# EAGLE design NSE2020_2 (EAGLE 9.4.2)
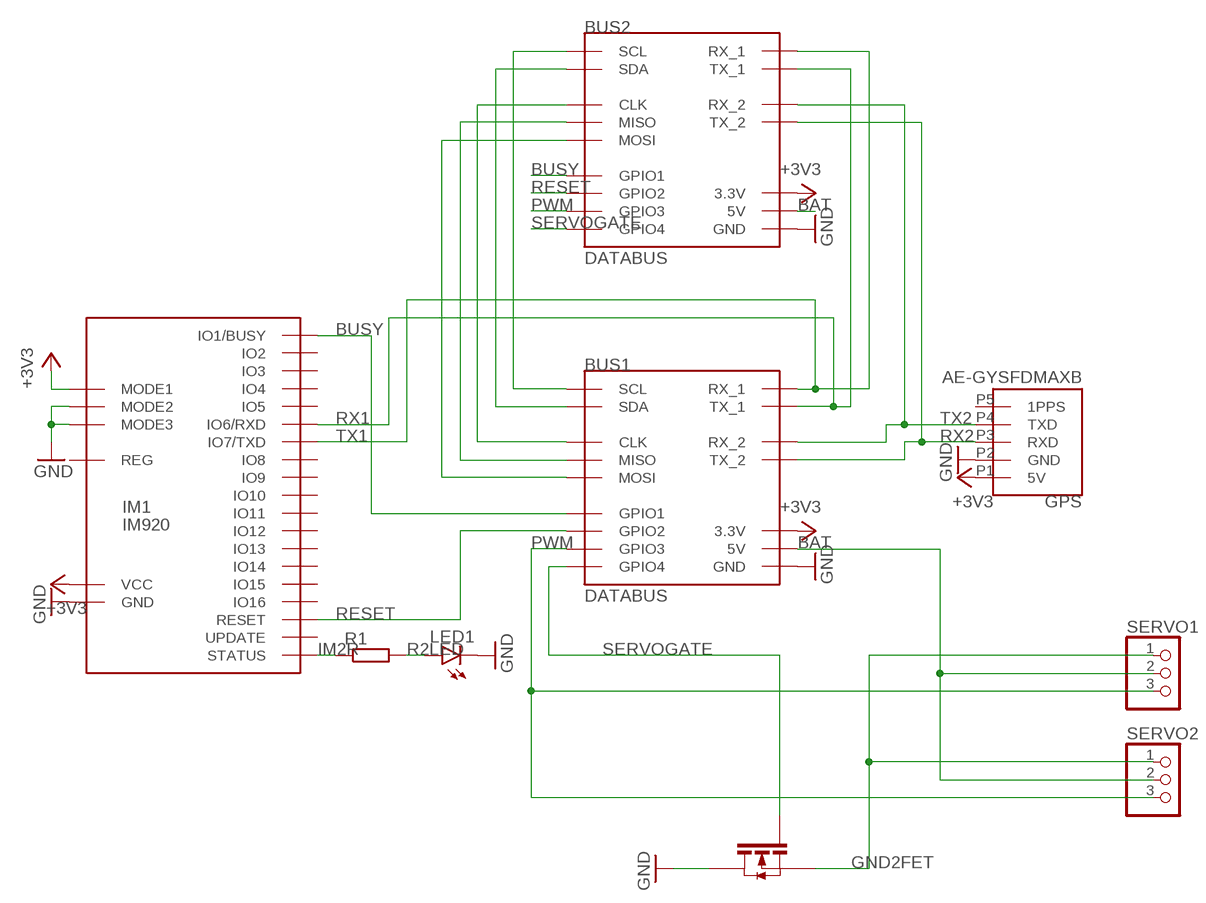
[diagram p0: schematic, sheet 1]

## Parts
BUS1  DATABUS  [8X2]
BUS2  DATABUS  [8X2]
FET1  2SK4033  [2SK4033]
GPS  AE-GYSFDMAXB  [AE-GYSFDMAXB]
IM1  IM920  [IM920]
LED1  LEDSMT1206  [1206]
R1  R-EU_M2012  [M2012]
SERVO1  PINHD-1X3  [1X03]
SERVO2  PINHD-1X3  [1X03]

## Nets
+3V3 [PWR]: BUS1.P6(3.3V) BUS2.P6(3.3V) GPS.P1(5V) IM1.IO2(VCC) IM1.IO5(MODE1)
BAT [PWR]: BUS1.P7(5V) BUS2.P7(5V) SERVO1.2 SERVO2.2
BUSY: BUS1.P3(GPIO1) BUS2.P3(GPIO1) IM1.IO13(IO1/BUSY)
GND [GND]: BUS1.P11(GND) BUS2.P11(GND) FET1.P$1(D) FET1.P$2(D) GPS.P2(GND) IM1.IO4(MODE3) IM1.IO22(MODE2) IM1.IO25(GND) LED1.C
GND2FET [GND]: FET1.P$4(S) SERVO1.1 SERVO2.1
IM2R: IM1.IO3(STATUS) R1.1
N$1: BUS1.P0(SCL) BUS2.P0(SCL)
N$2: BUS1.P13(SDA) BUS2.P13(SDA)
N$3: BUS1.P1(CLK) BUS2.P1(CLK)
N$4: BUS1.P12(MISO) BUS2.P12(MISO)
N$5: BUS1.P2(MOSI) BUS2.P2(MOSI)
PWM: BUS1.P14(GPIO3) BUS2.P14(GPIO3) SERVO1.3 SERVO2.3
R2LED: LED1.A R1.2
RESET: BUS1.P10(GPIO2) BUS2.P10(GPIO2) IM1.IO1(RESET)
RX1: BUS1.P5(TX_1) BUS2.P5(TX_1) IM1.IO16(IO6/RXD)
RX2: BUS1.P8(TX_2) BUS2.P8(TX_2) GPS.P3(RXD)
SERVOGATE: BUS1.P15(GPIO4) BUS2.P15(GPIO4) FET1.P$3(G)
TX1: BUS1.P4(RX_1) BUS2.P4(RX_1) IM1.IO10(IO7/TXD)
TX2: BUS1.P9(RX_2) BUS2.P9(RX_2) GPS.P4(TXD)
Unconnected: GPS.P5(1PPS) IM1.IO6(IO15) IM1.IO7(IO13) IM1.IO8(IO11) IM1.IO9 IM1.IO11(IO5) IM1.IO12(IO3) IM1.IO14(IO2) IM1.IO15(IO4) IM1.IO17(IO8) IM1.IO18(IO10) IM1.IO19(IO12) IM1.IO20(IO14) IM1.IO21(IO16) IM1.IO23(UPDATE) IM1.IO24(REG)

## Library data of the parts
BUS1 BUS2 = databus:DATABUS
FET1 = 2SK4033:2SK4033
GPS = AE-GYSFDMAXB:AE-GYSFDMAXB
IM1 = IM920:IM920
LED1 = led:LED: LED OSRAM: - CHIPLED LG R971, LG N971, LY N971, LG Q971, LY Q971, LO R971, LY R971 LH N974, LH R974 LS Q976, LO Q976, LY Q976 LO Q996 - Hyper CHIPLED LW Q18S LB Q993, LB Q99A, LB R99A - SideLED LS A670, LO A670, LY A670, LG A670, LP A670 LB A673, LV A673, LT A673, LW A673 LH A674 LY A675 LS A676, LA A676, LO A676, LY A676, LW A676 LS A679, LY A679, LG A679 - Hyper Micro SIDELED® LS Y876, LA Y876, LO Y876, LY Y876 LT Y87S - SmartLED LW L88C, LW L88S LB L89C, LB L89S, LG L890 LS L89K, LO L89K, LY L89K LS L896, LA L896, LO L896, LY L896 - TOPLED LS T670, LO T670, LY T670, LG T670, LP T670 LSG T670, LSP T670, LSY T670, LOP T670, LYG T670 LG T671, LOG T671, LSG T671 LB T673, LV T673, LT T673, LW T673 LH T674 LS T676, LA T676, LO T676, LY T676, LB T676, LH T676, LSB T676, LW T676 LB T67C, LV T67C, LT T67C, LS T67K, LO T67K, LY T67K, LW E67C LS E67B, LA E67B, LO E67B, LY E67B, LB E67C, LV E67C, LT E67C LW T67C LS T679, LY T679, LG T679 LS T770, LO T770, LY T770, LG T770, LP T770 LB T773, LV T773, LT T773, LW T773 LH T774 LS E675, LA E675, LY E675, LS T675 LS T776, LA T776, LO T776, LY T776, LB T776 LHGB T686 LT T68C, LB T68C - Hyper Mini TOPLED® LB M676 - Mini TOPLED Santana® LG M470 LS M47K, LO M47K, LY M47K Source: http://www.osram.convergy.de LUXEON: - LUMILED® LXK2-PW12-R00, LXK2-PW12-S00, LXK2-PW14-U00, LXK2-PW14-V00 LXK2-PM12-R00, LXK2-PM12-S00, LXK2-PM14-U00 LXK2-PE12-Q00, LXK2-PE12-R00, LXK2-PE12-S00, LXK2-PE14-T00, LXK2-PE14-U00 LXK2-PB12-K00, LXK2-PB12-L00, LXK2-PB12-M00, LXK2-PB14-N00, LXK2-PB14-P00, LXK2-PB14-Q00 LXK2-PR12-L00, LXK2-PR12-M00, LXK2-PR14-Q00, LXK2-PR14-R00 LXK2-PD12-Q00, LXK2-PD12-R00, LXK2-PD12-S00 LXK2-PH12-R00, LXK2-PH12-S00 LXK2-PL12-P00, LXK2-PL12-Q00, LXK2-PL12-R00 Source: www.luxeon.com KINGBRIGHT: KA-3528ASYC Source: www.kingbright.com
R1 = rcl:R-EU_: RESISTOR, European symbol; SPICEPREFIX: R
SERVO1 SERVO2 = pinhead:PINHD-1X3: PIN HEADER

## Net classes
1 GND: width 0.635 mm
2 PWR: width 0.635 mm

## Board
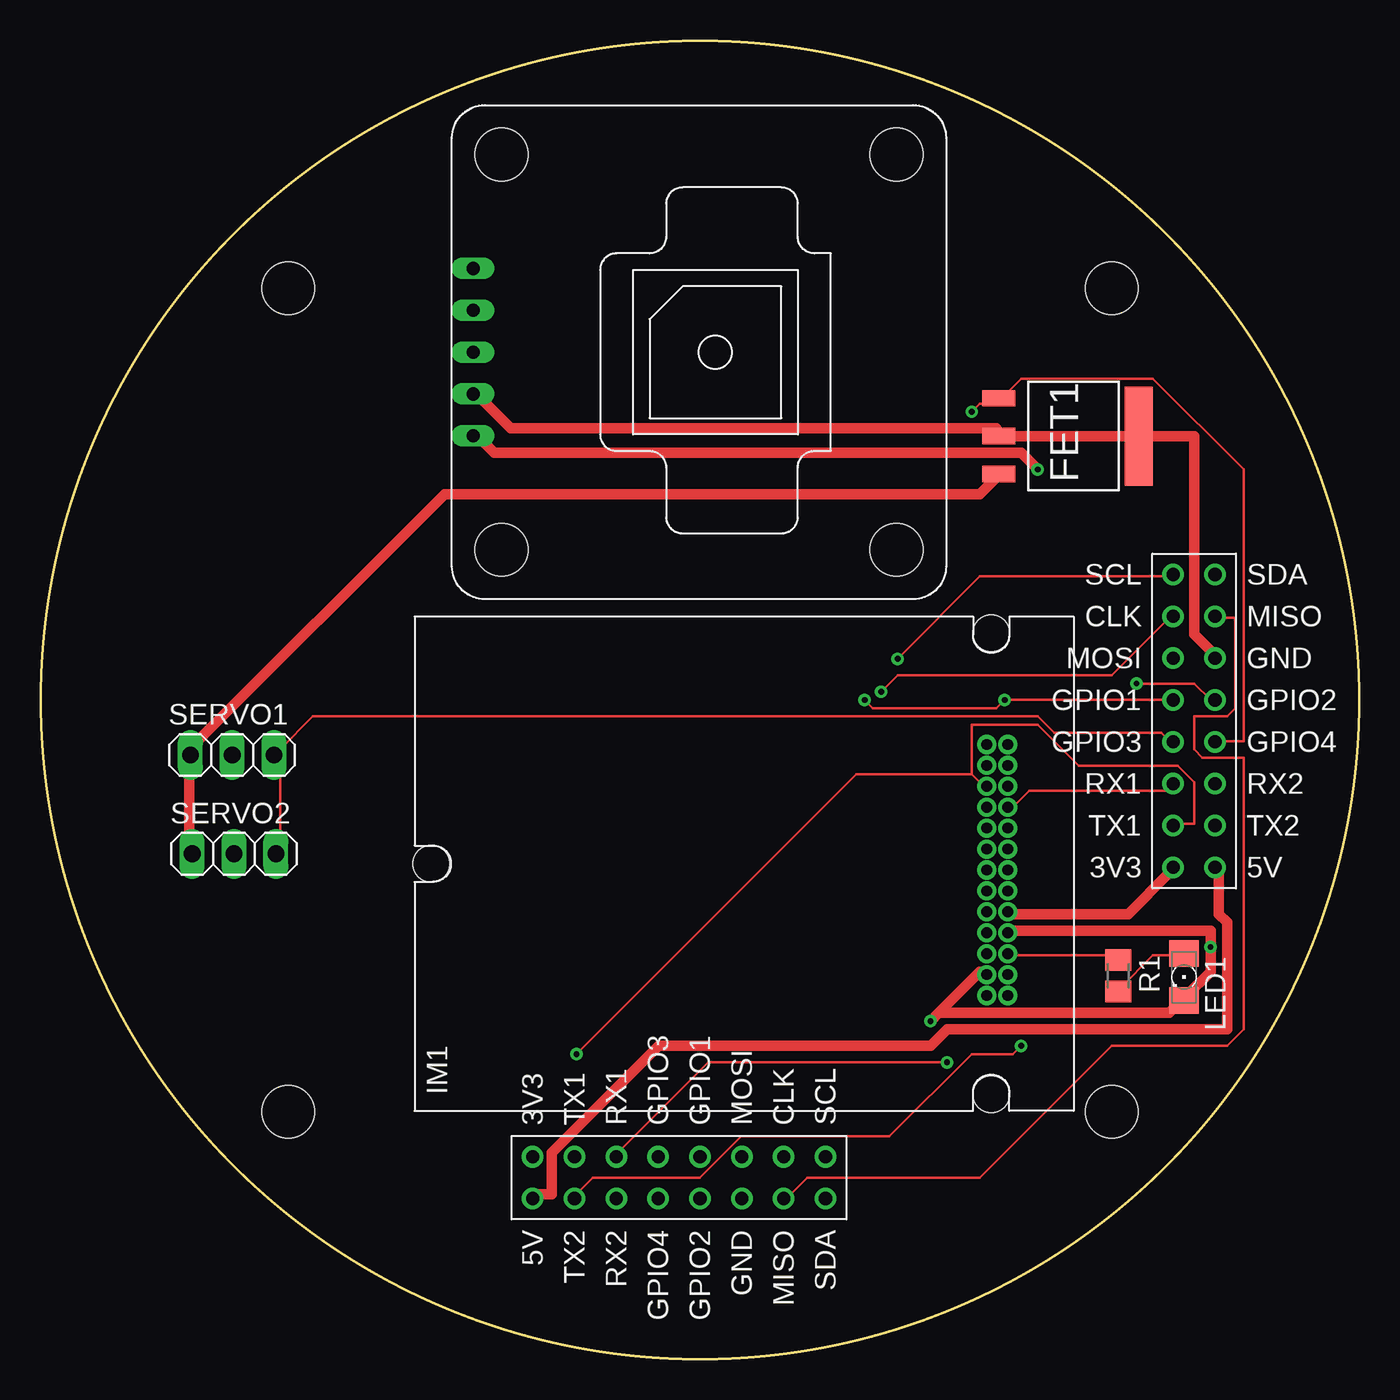
[diagram p1: board, top side]
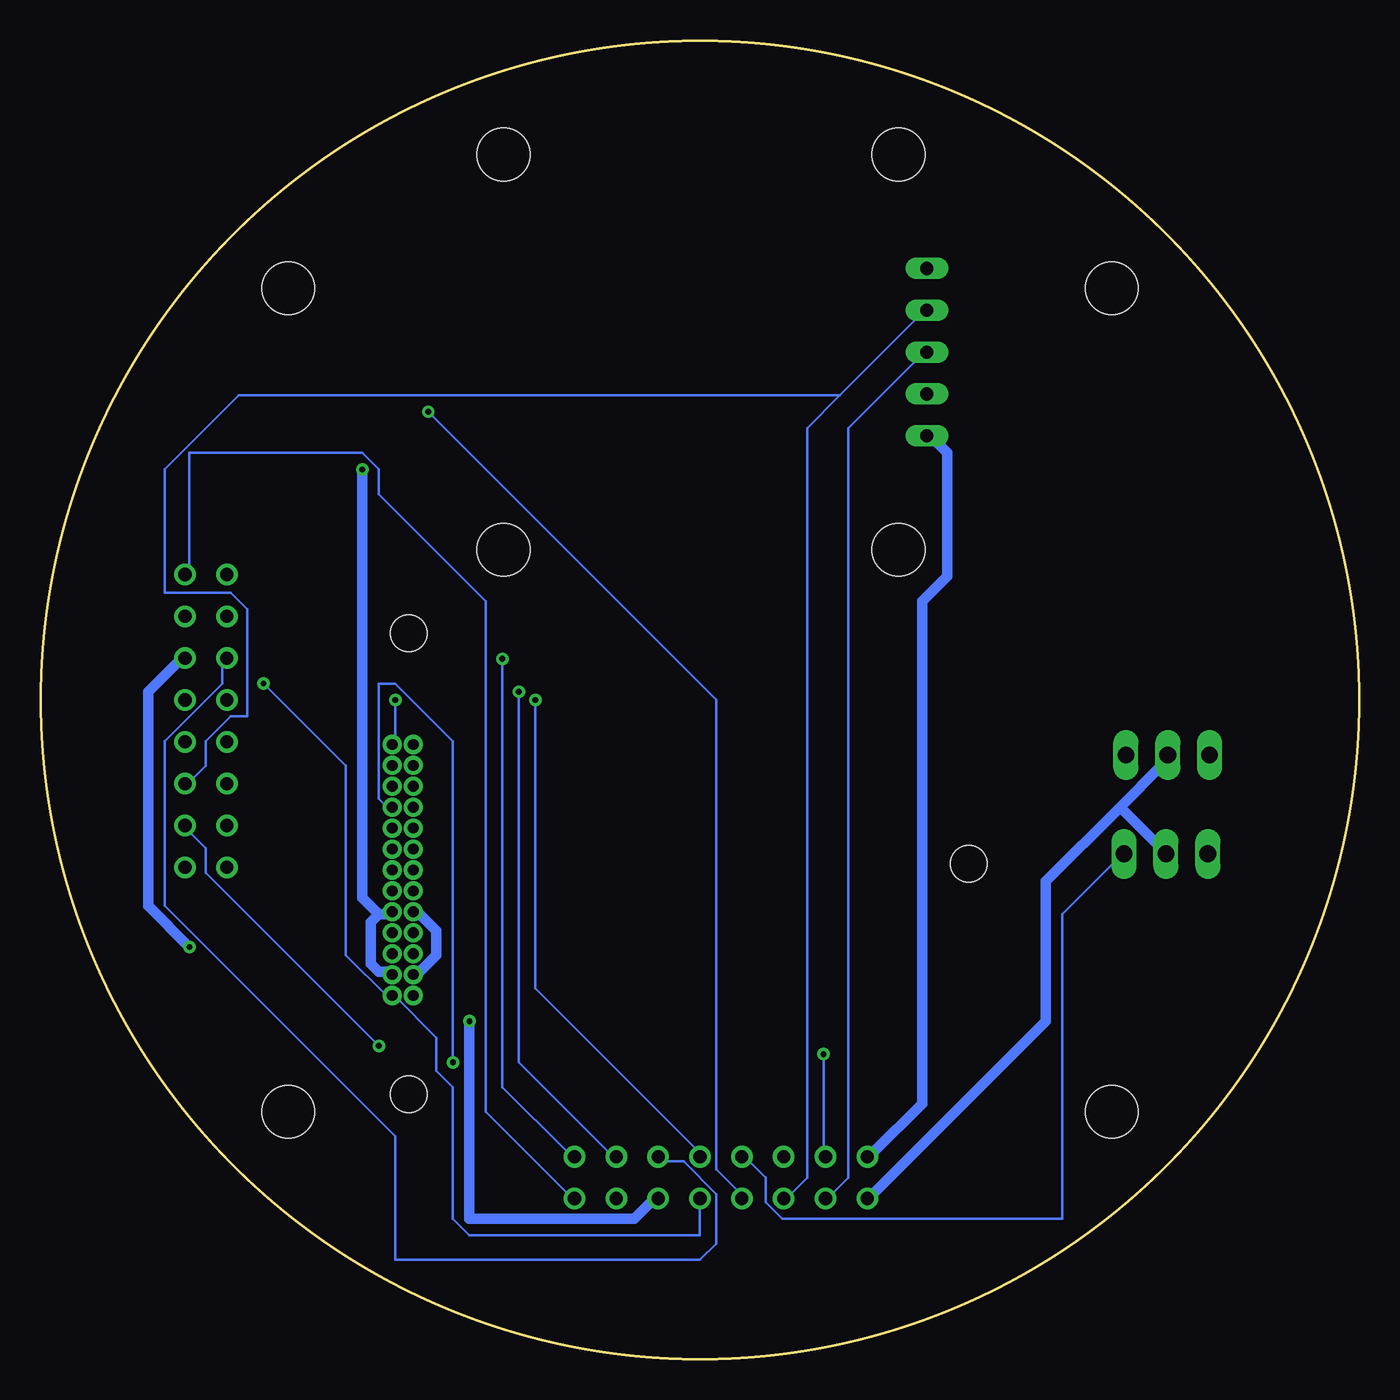
[diagram p2: board, bottom side, seen from below]

Size 80 x 80 mm. Coordinates in mm from the lower left corner, seen from the top.
Outline: circle at 40,40 radius 40
Copper layers (1*16): Top 0.035mm / dielectric 1.5mm / Bottom 0.035mm
Design rules "default": minimum track width 6mil, minimum drill 0.35mm, track to track 6mil, track to pad 6mil, pad to pad 6mil, via to via 6mil, smd to smd 6mil, copper to edge 40mil, drill to drill 6mil, minimum pad ring 10mil, minimum via ring 8mil, stop-mask expansion 4mil, vias tented up to drill 0mil, thermal gap 10mil
Holes 3.2 mm at 15,15 65,15 65,65 15,65

### Footprints (pad centres in the part's own frame; a part is rotated, then mirrored left to right if it is on the bottom)
8X2 = drill 0.8: P0 -1.27,7.62; P1 -1.27,5.08; P2 -1.27,2.54; P3 -1.27,0; P4 -1.27,-5.08; P5 -1.27,-7.62; P6 -1.27,-10.16; P7 1.27,-10.16; P8 1.27,-7.62; P9 1.27,-5.08; P10 1.27,0; P11 1.27,2.54; P12 1.27,5.08; P13 1.27,7.62; P14 -1.27,-2.54; P15 1.27,-2.54
2SK4033 = smd 6 x 1.7: P$1 3.3,6.7 | smd 1 x 2: P$2 3.3,-1.8; P$3 1,-1.8; P$4 5.6,-1.8
AE-GYSFDMAXB = drill 0.8 long: P1 13.716,5.08; P2 13.716,2.54; P3 13.716,0; P4 13.716,-2.54; P5 13.716,-5.08 | hole 3.2: -12,12; 12,12; 12,-12; -12,-12
IM920 = drill 0.65: IO1 -8,-16; IO2 -6.73,-16; IO3 -5.46,-16; IO4 -4.19,-16; IO5 -2.92,-16; IO6 -1.65,-16; IO7 -0.38,-16; IO8 0.89,-16; IO9 2.16,-16; IO10 3.43,-16; IO11 4.7,-16; IO12 5.97,-16; IO13 7.24,-16; IO14 7.24,-14.73; IO15 5.97,-14.73; IO16 4.7,-14.73; IO17 3.43,-14.73; IO18 2.16,-14.73; IO19 0.89,-14.73; IO20 -0.38,-14.73; IO21 -1.65,-14.73; IO22 -2.92,-14.73; IO23 -4.19,-14.73; IO24 -5.46,-14.73; IO25 -6.73,-14.73; IO26 -8,-14.73 | hole 2.2: -14,-15; 14,-15; 0,19
1206 = smd 1.6 x 1.803: A -1.422,0; C 1.422,0
M2012 = smd 1.3 x 1.6: 1 -0.95,0; 2 0.95,0
1X03 = drill 1.016 long: 1 -2.54,0; 2 0,0; 3 2.54,0

### Placement (x,y rotation side)
BUS1  40,11 270 top
BUS2  70,40 0 top
FET1  59.93,59.32 270 top
GPS  39.94,61.12 180 top
IM1  42.68,30.06 90 top
LED1  69.39,23.18 270 top
R1  65.39,23.26 270 top
SERVO1  11.6,36.66 0 top
SERVO2  11.71,30.66 0 top

### Tracks (layer width: path | path; a pad name or v marks a point on that pad's centre or on a via)
+3V3  (via drill 0.35)
  Top 0.635: BUS2.P6 68.5,29.5 66,27 59,27 IM1.IO5 | v60.5,54 59.5,55 27.5,55 26.5,56 GPS.P1
  Bottom 0.635: 59.5,27 60,26.5 60,24 59.5,23.5 59,23.5 IM1.IO2 | 59.5,27 59,27 IM1.IO5 | BUS1.P6 29.5,12.5 26.5,15.5 26.5,46 25,47.5 25,55 26,56 GPS.P1 | 59.5,27 60.5,28 v60.5,54
BAT
  Top 0.635: BUS2.P7 71.5,29.5 71.5,27 72,26.5 72,20 55,20 54,19 37.5,19 31,12.5 31,10 30,10 BUS1.P7
  Bottom 0.635: 14.5,33.5 12,36 12,36.5 SERVO1.2 | 14.5,33.5 19,29 19,20.5 29.5,10 BUS1.P7 | 14.5,33.5 12,31 SERVO2.2
BUSY  (via drill 0.35)
  Top 0.152: BUS2.P3 v58.5,40 58,39.5 50.5,39.5 v50,40
  Bottom 0.152: v58.5,40 58.5,37.5 IM1.IO13 | v50,40 50,22.5 40,12.5 BUS1.P3
GND  (via drill 0.35)
  Top 0.635: IM1.IO4 59,26 71,26 v71,25 71,23.5 69.5,22 LED1.C 69,21.5 68.5,21 54.5,21 | 54.5,21 57,23.5 IM1.IO25 | 54.5,21 v54,20.5 | BUS2.P11 71,43 70,44 70,56 67,56 FET1.P$1 66.5,56 58.5,56 FET1.P$2 58,56.5 28.5,56.5 26.5,58.5 GPS.P2
  Bottom 0.635: IM1.IO25 57,23.5 56,24.5 56,26 57,27 IM1.IO22 | v54,20.5 54,8.5 44,8.5 43,9.5 BUS1.P11 | v71,25 73.5,27.5 73.5,40.5 71.5,42.5 BUS2.P11
GND2FET
  Top 0.635: FET1.P$4 58,53.5 57,52.5 24.5,52.5 9,37 SERVO1.1 9,36.5 9,31 SERVO2.1
IM2R
  Top 0.152: R1.1 65,24.5 59,24.5 IM1.IO3
N$1  (via drill 0.35)
  Top 0.152: v52,42.5 57,47.5 68.5,47.5 BUS2.P0
  Bottom 0.152: v52,42.5 52,16.5 48,12.5 BUS1.P0
N$2
  Bottom 0.152: BUS1.P13 48,10 53,15 53,46 59.5,52.5 59.5,54 60.5,55 71,55 71,48 BUS2.P13
N$3  (via drill 0.35)
  Top 0.152: v51,40.5 52,41.5 65,41.5 68.5,45 BUS2.P1
  Bottom 0.152: v51,40.5 51,18 45.5,12.5 BUS1.P1
N$4
  Top 0.152: BUS1.P12 45.5,10 46.5,11 57,11 65,19 72,19 73,20 73,36.5 70.5,36.5 70,37 70,39 72,39 72.5,39.5 72.5,45 71.5,45 BUS2.P12
N$5
  Bottom 0.152: BUS1.P2 42.5,12 41,12 39,10 39,7 40,6 58.5,6 58.5,13.5 72.5,27.5 72.5,37.5 69,41 69,42.5 BUS2.P2
PWM
  Top 0.152: BUS2.P14 68.5,37.5 68,38 61.5,38 60.5,39 16.5,39 14.5,37 SERVO1.3 14.5,36.5 14.5,31 SERVO2.3
  Bottom 0.152: BUS1.P14 37,12 36,11 36,9.5 35,8.5 18,8.5 18,27 14.5,30.5 SERVO2.3
R2LED
  Top 0.152: R1.2 65.5,22.5 67.5,24.5 69,24.5 LED1.A
RESET  (via drill 0.35)
  Top 0.152: v66.5,41 70,41 71,40 BUS2.P10
  Bottom 0.152: BUS1.P10 40,7.5 54,7.5 55,8.5 55,16.5 56,17.5 56,19.5 58.5,22 IM1.IO1 59,22 61.5,24.5 61.5,36 v66.5,41
RX1  (via drill 0.35)
  Top 0.152: 56.5,35.5 57,35 IM1.IO16 | 56.5,35.5 56.5,38.5 60.5,38.5 63,36 69,36 70,35 70,32.5 69,32.5 BUS2.P5 | v32.5,18.5 49.5,35.5 56.5,35.5
  Bottom 0.152: v32.5,18.5 32.5,12.5 BUS1.P5
RX2  (via drill 0.35)
  Top 0.152: v59.5,19 59,18.5 56.5,18.5 51.5,13.5 42.5,13.5 40,11 33.5,11 32.5,10 BUS1.P8
  Bottom 0.152: BUS1.P8 32,10 31,11 31,56.5 26.5,61 GPS.P3 | v59.5,19 70,29.5 70,31 71,32 BUS2.P8
SERVOGATE  (via drill 0.35)
  Top 0.152: BUS2.P15 71.5,37.5 73,37.5 73,54 67.5,59.5 59.5,59.5 58.5,58.5 FET1.P$3 58,58 57,58 v56.5,57.5
  Bottom 0.152: v56.5,57.5 39,40 39,11.5 37.5,10 BUS1.P15
TX1  (via drill 0.35)
  Top 0.152: IM1.IO10 59,33.5 60,34.5 68.5,34.5 BUS2.P4 | v55,18 40.5,18 35,12.5 BUS1.P4
  Bottom 0.152: v55,18 55,37.5 58.5,41 59.5,41 59.5,34 59,33.5 IM1.IO10
TX2
  Bottom 0.152: 31.5,58.5 26.5,63.5 GPS.P4 | 31.5,58.5 33.5,56.5 33.5,11 34.5,10 BUS1.P9 | 31.5,58.5 68,58.5 72.5,54 72.5,46.5 68.5,46.5 67.5,45.5 67.5,39 68.5,39 70,37.5 70,36 71,35 BUS2.P9